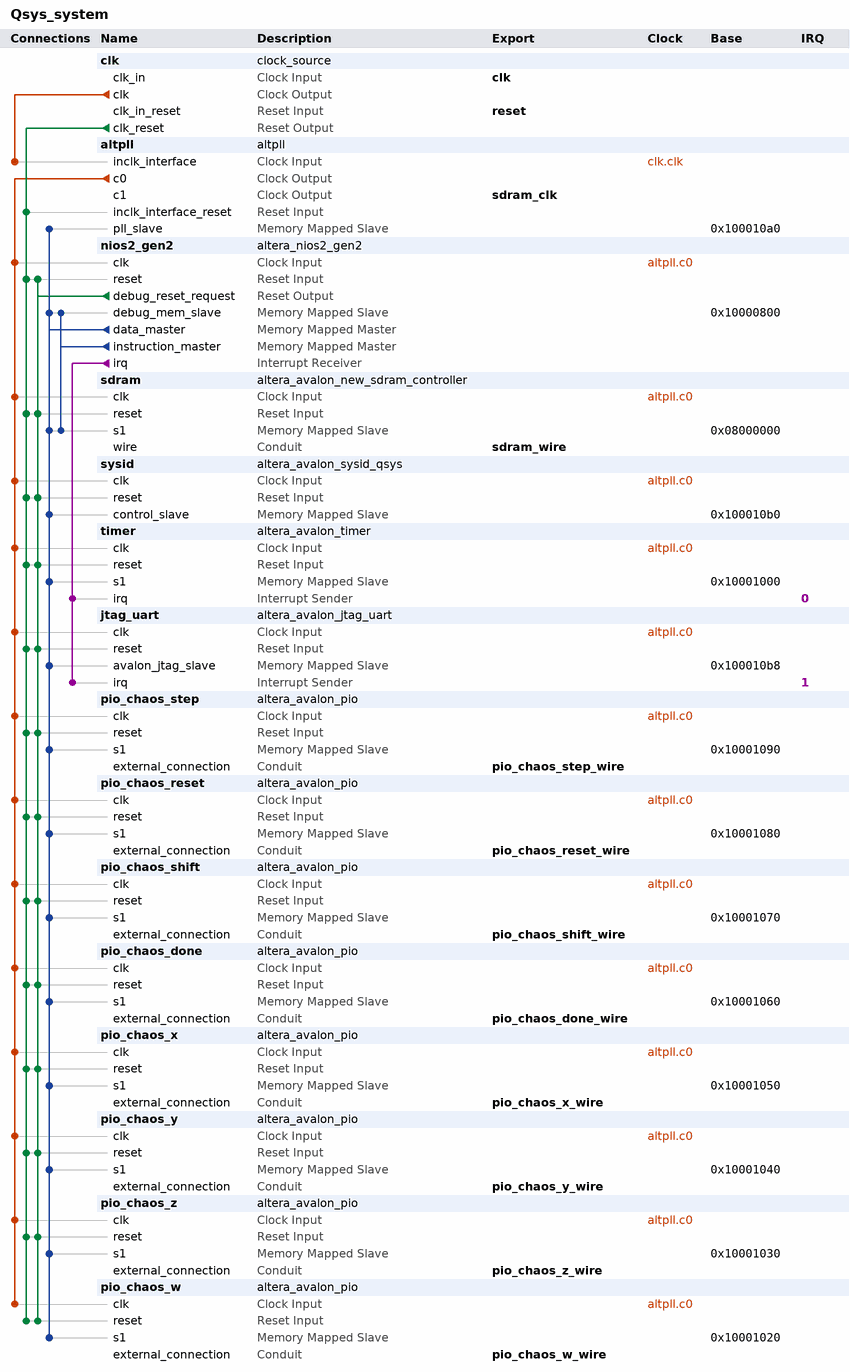
[diagram p0: system contents]
# Platform Designer (Qsys) system Qsys_system, Cyclone IV E EP4CE115F29C7
# Parameters at their usual value, and those the tool derives, are not listed.
package require -exact qsys 15.1
create_system Qsys_system
set_project_property DEVICE_FAMILY {Cyclone IV E}
set_project_property DEVICE EP4CE115F29C7

add_instance clk clock_source 15.1
set_instance_parameter_value clk clockFrequency 50000000

add_instance altpll altpll 15.1
set_instance_parameter_value altpll CLK0_DIVIDE_BY 1
set_instance_parameter_value altpll CLK0_MULTIPLY_BY 1
set_instance_parameter_value altpll CLK1_DIVIDE_BY 1
set_instance_parameter_value altpll CLK1_DUTY_CYCLE 50
set_instance_parameter_value altpll CLK1_MULTIPLY_BY 1
set_instance_parameter_value altpll CLK1_PHASE_SHIFT -3000
set_instance_parameter_value altpll INCLK0_INPUT_FREQUENCY 20000
set_instance_parameter_value altpll PORT_ARESET PORT_UNUSED
set_instance_parameter_value altpll PORT_LOCKED PORT_UNUSED
set_instance_parameter_value altpll PORT_clk1 PORT_USED
set_instance_parameter_value altpll PORT_clk2 PORT_UNUSED
set_instance_parameter_value altpll PORT_clk3 PORT_UNUSED

add_instance nios2_gen2 altera_nios2_gen2 15.1
set_instance_parameter_value nios2_gen2 dcache_size 2048
set_instance_parameter_value nios2_gen2 exceptionSlave sdram.s1
set_instance_parameter_value nios2_gen2 icache_size 4096
set_instance_parameter_value nios2_gen2 impl Fast
set_instance_parameter_value nios2_gen2 resetSlave sdram.s1

add_instance sdram altera_avalon_new_sdram_controller 15.1
set_instance_parameter_value sdram TAC 5.5
set_instance_parameter_value sdram TRCD 20.0
set_instance_parameter_value sdram TRP 20.0
set_instance_parameter_value sdram casLatency 3
set_instance_parameter_value sdram columnWidth 10
set_instance_parameter_value sdram dataWidth 32
set_instance_parameter_value sdram generateSimulationModel false
set_instance_parameter_value sdram model single_Micron_MT48LC4M32B2_7_chip
set_instance_parameter_value sdram numberOfBanks 4
set_instance_parameter_value sdram numberOfChipSelects 1
set_instance_parameter_value sdram powerUpDelay 200.0
set_instance_parameter_value sdram refreshPeriod 7.8125
set_instance_parameter_value sdram rowWidth 13

add_instance sysid altera_avalon_sysid_qsys 15.1
set_instance_parameter_value sysid id 0

add_instance timer altera_avalon_timer 15.1
set_instance_parameter_value timer period 1
set_instance_parameter_value timer periodUnits MSEC

add_instance jtag_uart altera_avalon_jtag_uart 15.1
set_instance_parameter_value jtag_uart simInteractiveOptions NO_INTERACTIVE_WINDOWS

add_instance pio_chaos_step altera_avalon_pio 15.1
set_instance_parameter_value pio_chaos_step direction Output
set_instance_parameter_value pio_chaos_step width 1

add_instance pio_chaos_reset altera_avalon_pio 15.1
set_instance_parameter_value pio_chaos_reset direction Output
set_instance_parameter_value pio_chaos_reset width 1

add_instance pio_chaos_shift altera_avalon_pio 15.1
set_instance_parameter_value pio_chaos_shift direction Output
set_instance_parameter_value pio_chaos_shift width 32

add_instance pio_chaos_done altera_avalon_pio 15.1
set_instance_parameter_value pio_chaos_done captureEdge true
set_instance_parameter_value pio_chaos_done direction Input
set_instance_parameter_value pio_chaos_done irqType EDGE
set_instance_parameter_value pio_chaos_done width 1

add_instance pio_chaos_x altera_avalon_pio 15.1
set_instance_parameter_value pio_chaos_x captureEdge true
set_instance_parameter_value pio_chaos_x direction Input
set_instance_parameter_value pio_chaos_x irqType EDGE
set_instance_parameter_value pio_chaos_x width 8

add_instance pio_chaos_y altera_avalon_pio 15.1
set_instance_parameter_value pio_chaos_y captureEdge true
set_instance_parameter_value pio_chaos_y direction Input
set_instance_parameter_value pio_chaos_y irqType EDGE
set_instance_parameter_value pio_chaos_y width 8

add_instance pio_chaos_z altera_avalon_pio 15.1
set_instance_parameter_value pio_chaos_z captureEdge true
set_instance_parameter_value pio_chaos_z direction Input
set_instance_parameter_value pio_chaos_z irqType EDGE
set_instance_parameter_value pio_chaos_z width 8

add_instance pio_chaos_w altera_avalon_pio 15.1
set_instance_parameter_value pio_chaos_w captureEdge true
set_instance_parameter_value pio_chaos_w direction Input
set_instance_parameter_value pio_chaos_w irqType EDGE
set_instance_parameter_value pio_chaos_w width 8

# connections
add_connection altpll.c0 jtag_uart.clk clock
add_connection altpll.c0 nios2_gen2.clk clock
add_connection altpll.c0 pio_chaos_done.clk clock
add_connection altpll.c0 pio_chaos_reset.clk clock
add_connection altpll.c0 pio_chaos_shift.clk clock
add_connection altpll.c0 pio_chaos_step.clk clock
add_connection altpll.c0 pio_chaos_w.clk clock
add_connection altpll.c0 pio_chaos_x.clk clock
add_connection altpll.c0 pio_chaos_y.clk clock
add_connection altpll.c0 pio_chaos_z.clk clock
add_connection altpll.c0 sdram.clk clock
add_connection altpll.c0 sysid.clk clock
add_connection altpll.c0 timer.clk clock
add_connection clk.clk altpll.inclk_interface clock
add_connection clk.clk_reset altpll.inclk_interface_reset reset
add_connection clk.clk_reset jtag_uart.reset reset
add_connection clk.clk_reset nios2_gen2.reset reset
add_connection clk.clk_reset pio_chaos_done.reset reset
add_connection clk.clk_reset pio_chaos_reset.reset reset
add_connection clk.clk_reset pio_chaos_shift.reset reset
add_connection clk.clk_reset pio_chaos_step.reset reset
add_connection clk.clk_reset pio_chaos_w.reset reset
add_connection clk.clk_reset pio_chaos_x.reset reset
add_connection clk.clk_reset pio_chaos_y.reset reset
add_connection clk.clk_reset pio_chaos_z.reset reset
add_connection clk.clk_reset sdram.reset reset
add_connection clk.clk_reset sysid.reset reset
add_connection clk.clk_reset timer.reset reset
add_connection nios2_gen2.debug_reset_request jtag_uart.reset reset
add_connection nios2_gen2.debug_reset_request nios2_gen2.reset reset
add_connection nios2_gen2.debug_reset_request pio_chaos_done.reset reset
add_connection nios2_gen2.debug_reset_request pio_chaos_reset.reset reset
add_connection nios2_gen2.debug_reset_request pio_chaos_shift.reset reset
add_connection nios2_gen2.debug_reset_request pio_chaos_step.reset reset
add_connection nios2_gen2.debug_reset_request pio_chaos_w.reset reset
add_connection nios2_gen2.debug_reset_request pio_chaos_x.reset reset
add_connection nios2_gen2.debug_reset_request pio_chaos_y.reset reset
add_connection nios2_gen2.debug_reset_request pio_chaos_z.reset reset
add_connection nios2_gen2.debug_reset_request sdram.reset reset
add_connection nios2_gen2.debug_reset_request sysid.reset reset
add_connection nios2_gen2.debug_reset_request timer.reset reset
add_connection nios2_gen2.data_master altpll.pll_slave avalon
set_connection_parameter_value nios2_gen2.data_master/altpll.pll_slave baseAddress 0x100010a0
add_connection nios2_gen2.data_master jtag_uart.avalon_jtag_slave avalon
set_connection_parameter_value nios2_gen2.data_master/jtag_uart.avalon_jtag_slave baseAddress 0x100010b8
add_connection nios2_gen2.data_master nios2_gen2.debug_mem_slave avalon
set_connection_parameter_value nios2_gen2.data_master/nios2_gen2.debug_mem_slave baseAddress 0x10000800
add_connection nios2_gen2.data_master pio_chaos_done.s1 avalon
set_connection_parameter_value nios2_gen2.data_master/pio_chaos_done.s1 baseAddress 0x10001060
add_connection nios2_gen2.data_master pio_chaos_reset.s1 avalon
set_connection_parameter_value nios2_gen2.data_master/pio_chaos_reset.s1 baseAddress 0x10001080
add_connection nios2_gen2.data_master pio_chaos_shift.s1 avalon
set_connection_parameter_value nios2_gen2.data_master/pio_chaos_shift.s1 baseAddress 0x10001070
add_connection nios2_gen2.data_master pio_chaos_step.s1 avalon
set_connection_parameter_value nios2_gen2.data_master/pio_chaos_step.s1 baseAddress 0x10001090
add_connection nios2_gen2.data_master pio_chaos_w.s1 avalon
set_connection_parameter_value nios2_gen2.data_master/pio_chaos_w.s1 baseAddress 0x10001020
add_connection nios2_gen2.data_master pio_chaos_x.s1 avalon
set_connection_parameter_value nios2_gen2.data_master/pio_chaos_x.s1 baseAddress 0x10001050
add_connection nios2_gen2.data_master pio_chaos_y.s1 avalon
set_connection_parameter_value nios2_gen2.data_master/pio_chaos_y.s1 baseAddress 0x10001040
add_connection nios2_gen2.data_master pio_chaos_z.s1 avalon
set_connection_parameter_value nios2_gen2.data_master/pio_chaos_z.s1 baseAddress 0x10001030
add_connection nios2_gen2.data_master sdram.s1 avalon
set_connection_parameter_value nios2_gen2.data_master/sdram.s1 baseAddress 0x08000000
add_connection nios2_gen2.data_master sysid.control_slave avalon
set_connection_parameter_value nios2_gen2.data_master/sysid.control_slave baseAddress 0x100010b0
add_connection nios2_gen2.data_master timer.s1 avalon
set_connection_parameter_value nios2_gen2.data_master/timer.s1 baseAddress 0x10001000
add_connection nios2_gen2.instruction_master nios2_gen2.debug_mem_slave avalon
set_connection_parameter_value nios2_gen2.instruction_master/nios2_gen2.debug_mem_slave baseAddress 0x10000800
add_connection nios2_gen2.instruction_master sdram.s1 avalon
set_connection_parameter_value nios2_gen2.instruction_master/sdram.s1 baseAddress 0x08000000
add_connection nios2_gen2.irq jtag_uart.irq interrupt
set_connection_parameter_value nios2_gen2.irq/jtag_uart.irq irqNumber 1
add_connection nios2_gen2.irq timer.irq interrupt
set_connection_parameter_value nios2_gen2.irq/timer.irq irqNumber 0

# exported interfaces
add_interface clk clock sink
set_interface_property clk EXPORT_OF clk.clk_in
add_interface pio_chaos_done_wire conduit end
set_interface_property pio_chaos_done_wire EXPORT_OF pio_chaos_done.external_connection
add_interface pio_chaos_reset_wire conduit end
set_interface_property pio_chaos_reset_wire EXPORT_OF pio_chaos_reset.external_connection
add_interface pio_chaos_shift_wire conduit end
set_interface_property pio_chaos_shift_wire EXPORT_OF pio_chaos_shift.external_connection
add_interface pio_chaos_step_wire conduit end
set_interface_property pio_chaos_step_wire EXPORT_OF pio_chaos_step.external_connection
add_interface pio_chaos_w_wire conduit end
set_interface_property pio_chaos_w_wire EXPORT_OF pio_chaos_w.external_connection
add_interface pio_chaos_x_wire conduit end
set_interface_property pio_chaos_x_wire EXPORT_OF pio_chaos_x.external_connection
add_interface pio_chaos_y_wire conduit end
set_interface_property pio_chaos_y_wire EXPORT_OF pio_chaos_y.external_connection
add_interface pio_chaos_z_wire conduit end
set_interface_property pio_chaos_z_wire EXPORT_OF pio_chaos_z.external_connection
add_interface reset reset sink
set_interface_property reset EXPORT_OF clk.clk_in_reset
add_interface sdram_clk clock source
set_interface_property sdram_clk EXPORT_OF altpll.c1
add_interface sdram_wire conduit end
set_interface_property sdram_wire EXPORT_OF sdram.wire

set_interconnect_requirement {$system} qsys_mm.clockCrossingAdapter HANDSHAKE
set_interconnect_requirement {$system} qsys_mm.enableEccProtection FALSE
set_interconnect_requirement {$system} qsys_mm.insertDefaultSlave FALSE
set_interconnect_requirement {$system} qsys_mm.maxAdditionalLatency 1

save_system Qsys_system.qsys
